# EAGLE design glowbelt (EAGLE 6.1)
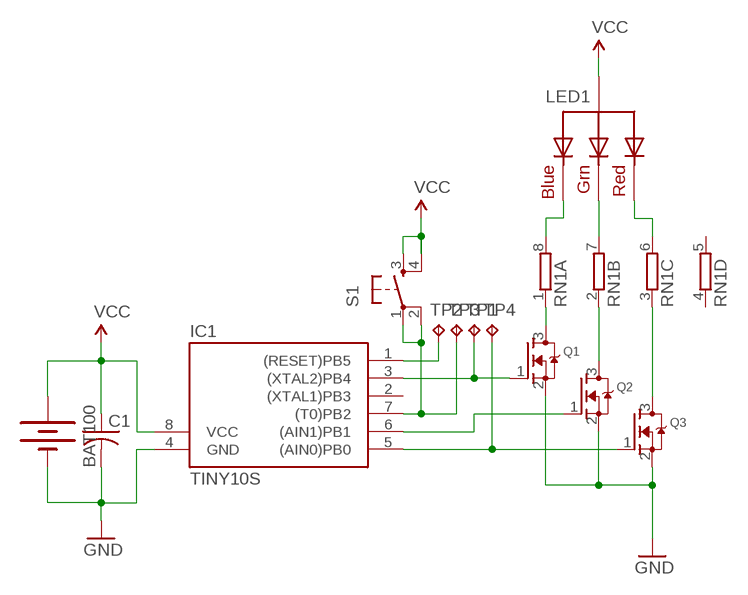
[diagram p0: schematic, sheet 1]

## Parts
BAT100  BATTERY20SMD  [BATTCON_20MM]
C1  C-USC1206  [C1206]
IC1  TINY10S  [SOIC8]
LED1  RGBLED_CA-5MM  [LED5MMRGB]
Q1  MOSFET-NREFLOW  [SOT23]
Q2  MOSFET-NREFLOW  [SOT23]
Q3  MOSFET-NREFLOW  [SOT23]
RN1  4R-NEXBS8V  [EXBS8V]
S1  TAC_SWITCHSMD  [TACTILE_SWITCH_SMD]
TP1  TPB1,27  [B1,27]
TP2  TPB1,27  [B1,27]
TP3  TPB1,27  [B1,27]
TP4  TPB1,27  [B1,27]

## Nets
GND: BAT100.2(-) C1.2 IC1.4(GND) Q1.2(S) Q2.2(S) Q3.2(S)
MISO: IC1.3((XTAL2)PB4) Q1.1(G) TP1.TP
MOSI: IC1.5((AIN0)PB0) Q3.1(G) TP4.TP
N$1: IC1.6((AIN1)PB1) Q2.1(G)
N$2: Q1.3(D) RN1.1
N$3: Q2.3(D) RN1.2
N$4: Q3.3(D) RN1.3
N$5: LED1.3(GREEN) RN1.7
N$6: LED1.4(BLUE) RN1.8
N$7: LED1.1(RED) RN1.6
RST: IC1.1((RESET)PB5) TP2.TP
SCK: IC1.7((T0)PB2) S1.1 S1.2 TP3.TP
VCC: BAT100.1(+) C1.1 IC1.8(VCC) LED1.2(VCC) S1.3 S1.4
Unconnected: IC1.2((XTAL1)PB3) RN1.4 RN1.5

## Library data of the parts
BAT100 = sparkfun:BATTERY: Battery Holders Various common sizes : AA, AAA, 20mm coin cell and 12mm coin cell.
C1 = adafruit:C-US: CAPACITOR, American symbol
IC1 = atmel:TINY10: MICROCONTROLLER 1 Kbytes ROM; OC_FARNELL: unknown; OC_NEWARK: unknown
LED1 = adafruit:RGBLED_CA: RGB LED, common-anode 5MM Staggered pins 5mm Piranha package http://www.ladyada.net/library/pcb/eaglelibrary.html
Q1-Q3 = adafruit:MOSFET-N: N-Channel Mosfet 2N7002E - 60V 260mA SOT23 [Digikey: 2N7002ET1GOSTR-ND] - REEL BSH103 - 30V 850mA SOT23 [Digikey: 568-5013-1-ND]
RN1 = resistor-dil:4R-N: Array Chip Resistor Source: RS Component / Phycomp; OC_FARNELL: unknown; OC_NEWARK: unknown
S1 = sparkfun:TAC_SWITCH: Momentary Switch Button commonly used for reset or general input. Spark Fun Electronics SKU : COM-00097
TP1-TP4 = testpad:TP: Test pad

## Board
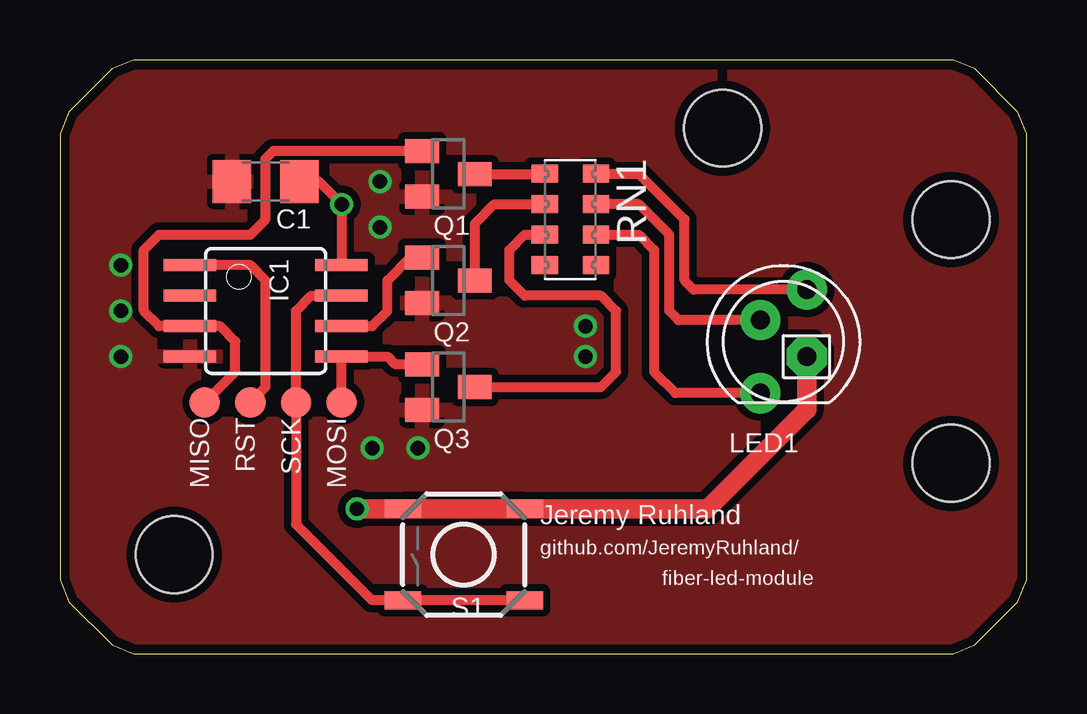
[diagram p1: board, top side]
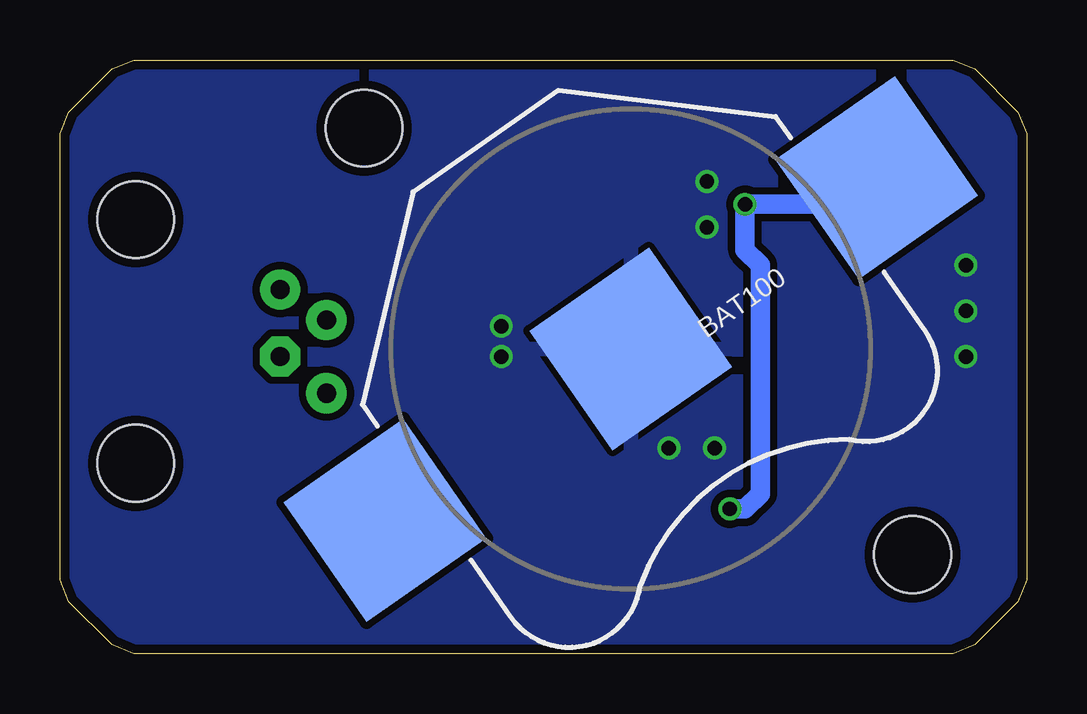
[diagram p2: board, bottom side, seen from below]

Size 40.3 x 24.75 mm. Coordinates in mm from the lower left corner, seen from the top.
Outline: 0,21.69 0,3.07 0.37,2.17 2.17,0.37 3.07,0 37.24,0 38.13,0.37 39.93,2.17 40.3,3.07 40.3,21.69 39.93,22.58 38.13,24.38 37.24,24.75 3.07,24.75 2.17,24.38 0.37,22.58 0,21.69
Copper layers (1*16): Top 0.0356mm / dielectric 1.5011mm / Bottom 0.0356mm
Design rules: minimum track width 6mil, minimum drill 13mil, track to track 6mil, track to pad 6mil, pad to pad 6mil, via to via 6mil, smd to smd 6mil, copper to edge 15mil, drill to drill 6mil, minimum pad ring 7mil, minimum via ring 7mil, stop-mask expansion 4mil, vias tented up to drill 0mil, thermal gap 10mil
Holes 3.2 mm at 37.15,18.1 37.15,7.94 27.62,21.91 4.76,4.13

### Footprints (pad centres in the part's own frame; a part is rotated, then mirrored left to right if it is on the bottom)
BATTCON_20MM = smd 6.07 x 6.07: 1 -12.5,0; 2 0,0; 3 12.5,0
C1206 = smd 1.6 x 1.8: 1 -1.4,0; 2 1.4,0
SOIC8 = smd 0.5 x 2.2: 1 -1.905,-3.154; 2 -0.645,-3.154; 3 0.625,-3.154; 4 1.895,-3.154; 5 1.905,3.154; 6 0.635,3.154; 7 -0.635,3.154; 8 -1.905,3.154
LED5MMRGB = drill 0.8 pad 1.676: 1 -2.159,0.968; 3 0.889,0.968; 4 2.159,-0.968 | drill 0.8 pad 1.676 octagon: 2 -0.635,-0.968
SOT23 = smd 1 x 1.4: 1 -0.95,-1.1; 2 0.95,-1.1; 3 0,1.1
EXBS8V = smd 0.75 x 1.1: 1 -1.905,-1.07; 2 -0.635,-1.07; 3 0.635,-1.07; 4 1.905,-1.07; 5 1.905,1.07; 6 0.635,1.07; 7 -0.635,1.07; 8 -1.905,1.07
TACTILE_SWITCH_SMD = smd 1.524 x 0.762: 1 -2.54,1.905; 2 2.54,1.905; 3 -2.54,-1.905; 4 2.54,-1.905
B1,27 = smd 1.27 x 1.27: TP 0,0

### Placement (x,y rotation side)
BAT100  16.51,12.7 214.9 bottom
C1  8.57,19.68 180 top
IC1  8.57,14.29 270 top
LED1  30.16,13.02 90 top
Q1  16.19,20 270 top
Q2  16.19,15.56 270 top
Q3  16.19,11.11 270 top
RN1  21.27,18.1 270 top
S1  16.83,4.13 180 top
TP1  6.03,10.48 180 top
TP2  7.94,10.48 180 top
TP3  9.84,10.48 180 top
TP4  11.75,10.48 180 top

### Tracks (layer width: path | path; a pad name or v marks a point on that pad's centre or on a via)
GND  (via drill 0.6)
  other vias: 13.33,19.68 13.33,17.78 21.91,12.38 21.91,13.65 14.92,8.57 13.02,8.57 2.54,12.38 2.54,14.29 2.54,16.19
  pour Top (isolate 0.305): 40.64,24.45 0,24.45 0,0.32 40.64,0.32
  pour Bottom (isolate 0.305): 40.64,24.45 0,24.45 0,0.32 40.64,0.32
MISO
  Top 0.406: 5.43,13.65 6.67,13.65 7.3,13.02 7.3,11.75 TP1.TP | 5.43,13.65 IC1.3 | 5.43,13.65 4.13,13.65 3.49,14.29 3.49,16.83 4.13,17.46 7.94,17.46 8.57,18.1 8.57,20.64 8.89,20.95 Q1.1
MOSI
  Top 0.406: Q3.1 13.97,12.06 13.65,12.38 IC1.5 11.75,12.36 TP4.TP
N$1
  Top 0.406: IC1.6 13.02,13.65 13.65,14.29 13.65,15.56 14.6,16.51 Q2.1
N$2
  Top 0.406: Q1.3 RN1.1
N$3
  Top 0.406: Q2.3 17.29,17.93 18.1,18.73 RN1.2
N$4
  Top 0.406: Q3.3 22.54,11.11 23.18,11.75 23.18,14.29 22.54,14.92 19.37,14.92 18.73,15.56 18.73,16.83 19.37,17.46 RN1.3
N$5
  Top 0.406: LED1.3 25.78,13.91 25.4,14.29 25.4,17.46 24.13,18.73 RN1.7
N$6
  Top 0.406: LED1.4 26.42,15.18 26.03,15.56 26.03,18.1 24.13,20 RN1.8
N$7
  Top 0.406: RN1.6 24.13,17.46 24.76,16.83 24.76,11.75 25.65,10.86 LED1.1
N$8
  cutout Top: 20,20.64 22.54,20.64 22.54,15.56 20,15.56
RST
  Top 0.406: IC1.1 7.94,16.19 8.57,15.56 8.57,11.11 TP2.TP
SCK
  Top 0.406: IC1.7 10.48,14.92 9.84,14.29 TP3.TP 9.84,5.4 13.02,2.22 S1.2 S1.1
VCC  (via drill 0.6)
  Top 0.406: IC1.8 11.75,16.21 v11.75,18.73 10.8,19.68 C1.1
  Top 0.813: LED1.2 31.13,10.18 26.99,6.03 S1.3 S1.4 v12.38,6.03
  Bottom 0.813: BAT100.1 7.38,18.73 v11.75,18.73 11.75,16.83 11.11,16.19 11.11,6.67 11.75,6.03 v12.38,6.03

### Text on the board
_tsilk: MISO | RST | SCK | MOSI | Jeremy Ruhland | github.com/JeremyRuhland/ | fiber-led-module